# EAGLE design Drone_SMD (EAGLE 9.6.2)
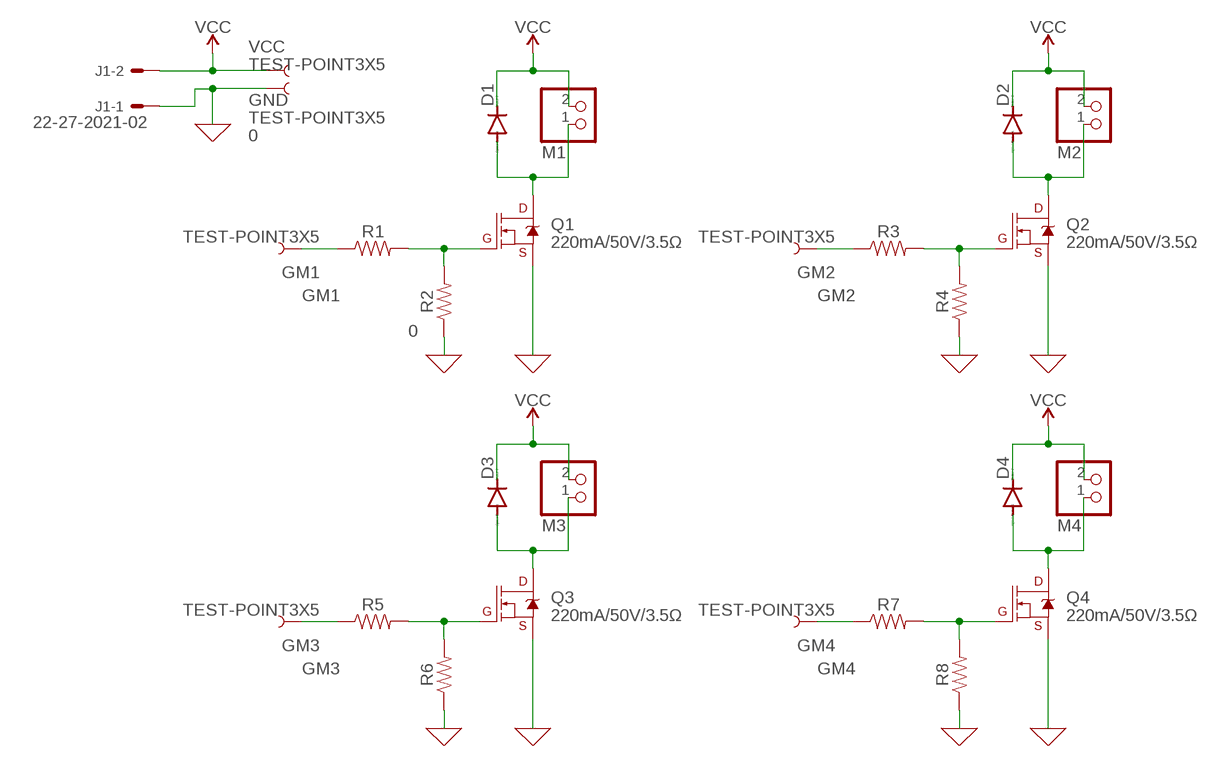
[diagram p0: schematic, sheet 1]

## Parts
D1  DIODE-DO-214AC  [DO-214AC]
D2  DIODE-DO-214AC  [DO-214AC]
D3  DIODE-DO-214AC  [DO-214AC]
D4  DIODE-DO-214AC  [DO-214AC]
GM1  TEST-POINT3X5  [PAD.03X.05]
GM2  TEST-POINT3X5  [PAD.03X.05]
GM3  TEST-POINT3X5  [PAD.03X.05]
GM4  TEST-POINT3X5  [PAD.03X.05]
GND  TEST-POINT3X5  [PAD.03X.05]
J1  22-27-2021-02  [6410-02]
M1  PINHD-1X2  [1X02]
M2  PINHD-1X2  [1X02]
M3  PINHD-1X2  [1X02]
M4  PINHD-1X2  [1X02]
Q1  220mA/50V/3.5Ω  MOSFET-NCH-BSS138  [SOT23-3]
Q2  220mA/50V/3.5Ω  MOSFET-NCH-BSS138  [SOT23-3]
Q3  220mA/50V/3.5Ω  MOSFET-NCH-BSS138  [SOT23-3]
Q4  220mA/50V/3.5Ω  MOSFET-NCH-BSS138  [SOT23-3]
R1  RESISTOR1206  [1206]
R2  RESISTOR1206  [1206]
R3  RESISTOR1206  [1206]
R4  RESISTOR1206  [1206]
R5  RESISTOR1206  [1206]
R6  RESISTOR1206  [1206]
R7  RESISTOR1206  [1206]
R8  RESISTOR1206  [1206]
VCC  TEST-POINT3X5  [PAD.03X.05]

## Nets
0: GND.1 J1.1 Q1.2(S) Q2.2(S) Q3.2(S) Q4.2(S) R2.1 R4.1 R6.1 R8.1 ; supply symbol labelled GND
GM1: GM1.1 R1.1
GM2: GM2.1 R3.1
GM3: GM3.1 R5.1
GM4: GM4.1 R7.1
N$2: Q1.1(G) R1.2 R2.2
N$3: D1.A M1.1 Q1.3(D)
N$5: Q2.1(G) R3.2 R4.2
N$6: D2.A M2.1 Q2.3(D)
N$8: Q3.1(G) R5.2 R6.2
N$9: D3.A M3.1 Q3.3(D)
N$11: Q4.1(G) R7.2 R8.2
N$12: D4.A M4.1 Q4.3(D)
VCC: D1.C D2.C D3.C D4.C J1.2 M1.2 M2.2 M3.2 M4.2 VCC.1

## Library data of the parts
D1-D4 = diode:DIODE-: DIODE
GM1-GM4 GND VCC = SparkFun-Connectors:TEST-POINT: SparkFun Test Points Bare copper test points for troubleshooting or In-Circuit-Testing. These are used by our Production team for verifying production board runs using pogo-pins on test beds. SparkFun Products: SparkFun LSM9DS1 Breakout <https://www.sparkfun.com/products/13284> SparkFun PSOC <https://www.sparkfun.com/products/13714> SparkFun Load Cell Amplifier <https://www.sparkfun.com/products/13879>
J1 = con-molex:22-?-02: CONNECTOR wire to board 2.54 mm (.1 inch) pitch header; MF: MOLEX; OC_FARNELL: unknown; OC_NEWARK: unknown
M1-M4 = pinhead:PINHD-1X2: PIN HEADER
Q1-Q4 = SparkFun-DiscreteSemi:MOSFET-NCH: N-channel MOSFETs Voltage controlled devices that allow control of high current outputs. SparkFun Products: SparkFun OpenScale <https://www.sparkfun.com/products/13261> SparkFun Digital Sandbox <https://www.sparkfun.com/products/12651> SparkFun Monster Moto Shield <https://www.sparkfun.com/products/10182> SparkFun MOSFET Power Controller <https://www.sparkfun.com/products/11214>; PROD_ID: TRANS-00830
R1-R8 = SparkFun-Resistors:RESISTOR: Generic Resistor Package

## Board
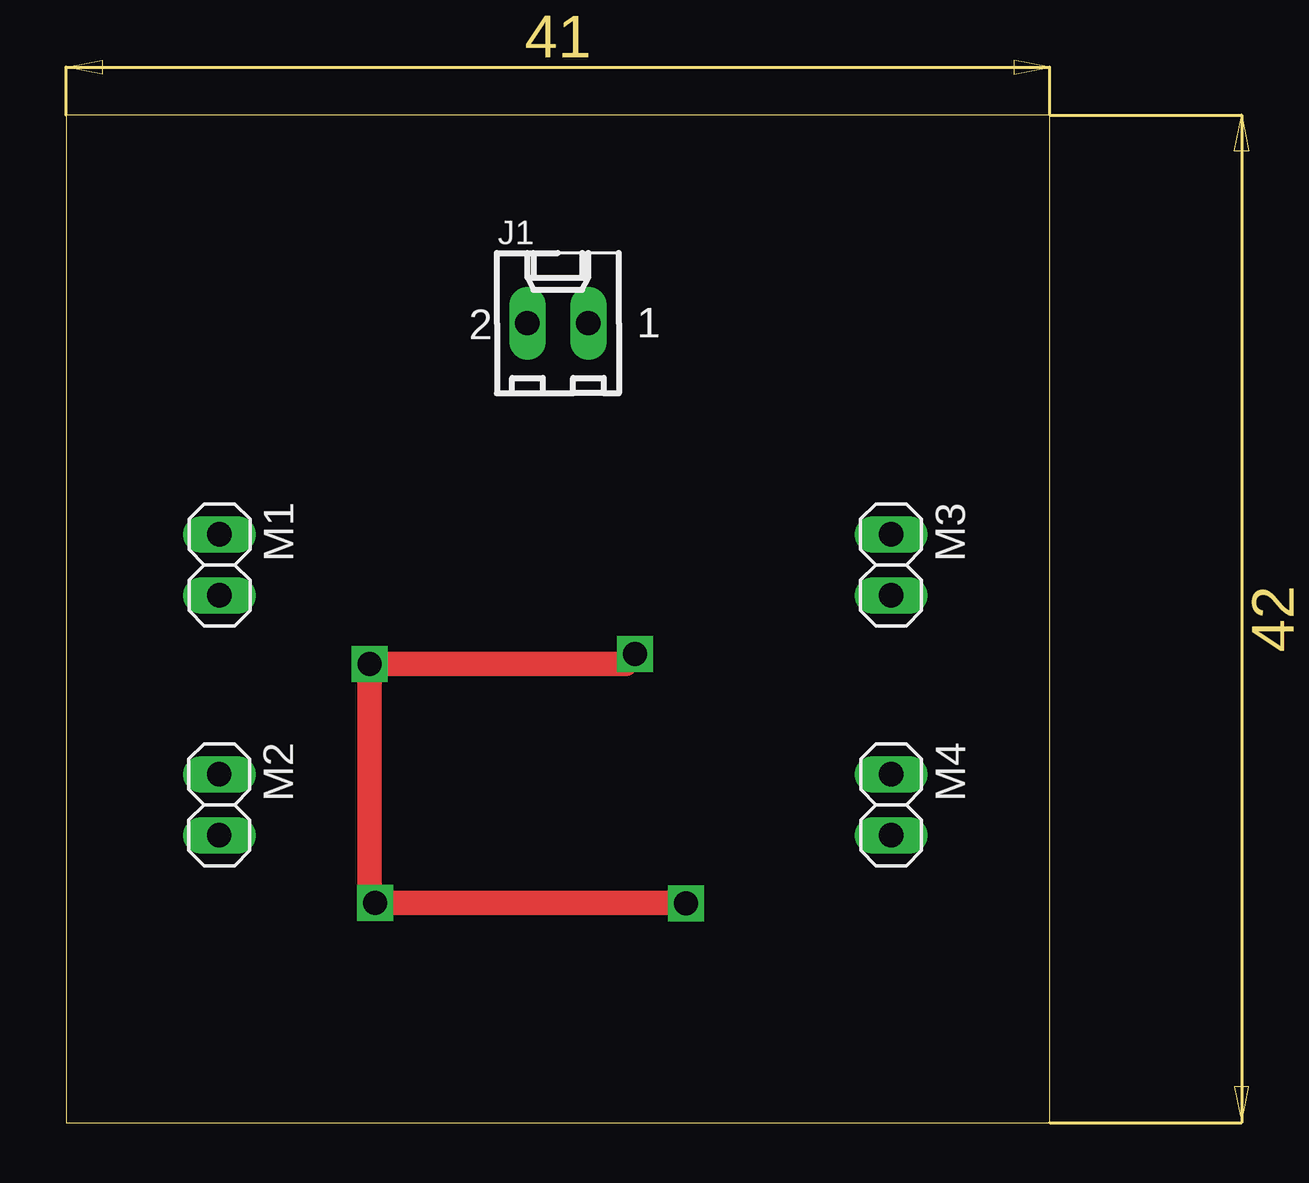
[diagram p1: board, top side]
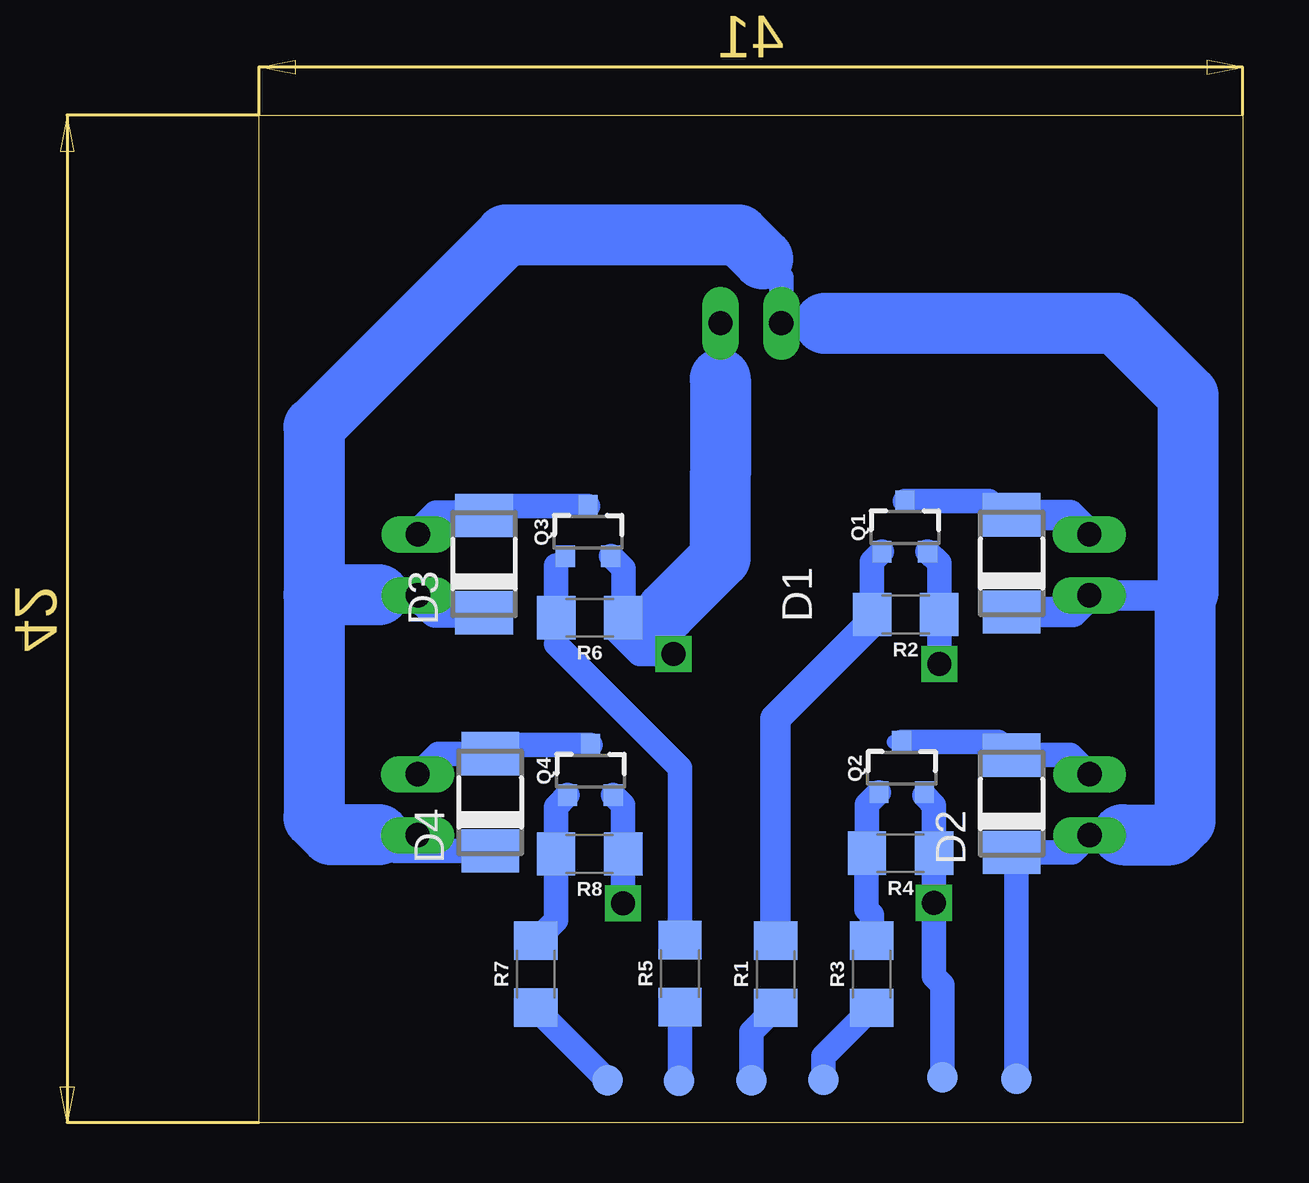
[diagram p2: board, bottom side, seen from below]

Size 41 x 42 mm. Coordinates in mm from the lower left corner, seen from the top.
Outline: 0,0 41,0 41,42 0,42 0,0
Copper layers (1*16): Top 0.035mm / dielectric 1.5mm / Bottom 0.035mm
Design rules "default": minimum track width 6mil, minimum drill 0.35mm, track to track 6mil, track to pad 6mil, pad to pad 6mil, via to via 6mil, smd to smd 6mil, copper to edge 40mil, drill to drill 6mil, minimum pad ring 10mil, minimum via ring 8mil, stop-mask expansion 4mil, vias tented up to drill 0mil, thermal gap 10mil

### Footprints (pad centres in the part's own frame; a part is rotated, then mirrored left to right if it is on the bottom)
DO-214AC = smd 1.8 x 2.4: A 2.025,0; C -2.025,0
PAD.03X.05 = smd 1.27 x 1.27: 1 0,0
6410-02 = drill 1.016 long: 1 1.27,0; 2 -1.27,0
1X02 = drill 1.016 long: 1 -1.27,0; 2 1.27,0
SOT23-3 = smd 0.8 x 0.9: 1 -0.95,-1; 2 0.95,-1; 3 0,1.1
1206 = smd 1.6 x 1.8: 1 -1.4,0; 2 1.4,0

### Placement (x,y rotation side)
D1  9.63,23.32 90 bottom
D2  9.63,13.3 90 bottom
D3  31.62,23.29 90 bottom
D4  31.37,13.36 90 bottom
GM1  20.47,1.77 270 bottom
GM2  17.48,1.78 270 bottom
GM3  23.5,1.76 270 bottom
GM4  26.48,1.77 270 bottom
GND  12.52,1.89 90 bottom
J1  20.5,33.33 0 top
M1  6.39,23.25 270 top
M2  6.38,13.25 270 top
M3  34.38,23.25 270 top
M4  34.39,13.26 270 top
Q1  14.08,24.81 0 bottom
Q2  14.22,14.77 0 bottom
Q3  27.29,24.62 0 bottom
Q4  27.19,14.66 0 bottom
R1  19.47,6.19 90 bottom
R2  14.05,21.18 180 bottom
R3  15.46,6.19 90 bottom
R4  14.27,11.24 180 bottom
R5  23.46,6.22 90 bottom
R6  27.22,21.05 180 bottom
R7  29.46,6.2 90 bottom
R8  27.22,11.2 180 bottom
VCC  9.44,1.84 0 bottom

### Tracks (layer width: path | path; a pad name or v marks a point on that pad's centre or on a via)
0  (via drill 1)
  Top 1.016: v23.72,19.54 23.31,19.13 v12.65,19.13 12.65,9.39 v12.88,9.16 25.82,9.16 v25.83,9.15
  Bottom 0.61: 25.82,21.33 R6.1 | Q4.2 26.24,13.57 | Q2.2 13.27,13.64 13.27,13.6
  Bottom 1.016: J1.1 21.77,31 | v12.65,19.13 R2.1 12.65,23.32 Q1.2 | Q3.2 25.82,23.09 R6.1 25.24,21.05 v23.72,19.54 | Q4.2 25.82,13.24 R8.1 v25.83,9.15 | 13.27,13.64 12.87,13.23 R4.1 12.88,11.22 v12.88,9.16 12.88,6.11 12.52,5.74 GND.1 | v23.72,19.54 23.72,21.05 24,21.33 | v23.72,19.54 25.13,19.54 26.11,20.52
  Bottom 1.27: 24,21.33 25.82,21.33
  Bottom 2.54: 21.77,31 21.77,27 21.77,23.56 24,21.33
GM1
  Bottom 1.016: R1.1 20.47,3.79 GM1.1
GM2
  Bottom 1.016: GM2.1 17.48,2.78 R3.1
GM3
  Bottom 0.61: 23.46,1.79 GM3.1
  Bottom 1.016: R5.1 23.46,1.79
GM4
  Bottom 0.61: 29.46,4.75 R7.1
  Bottom 1.016: GM4.1 29.46,4.75
N$2
  Bottom 0.61: 15.6,21.33 R2.2
  Bottom 1.016: Q1.1 15.45,23.39 R2.2
  Bottom 1.27: R1.2 19.47,16.86 15.6,20.73 15.6,21.33
N$3
  Bottom 0.61: 10.01,25.34 D1.A
  Bottom 1.016: Q1.3 10.58,25.91 10.01,25.34
  Bottom 1.27: M1.1 7.21,25.34 D1.A
N$5
  Bottom 0.61: 15.46,11.04 R4.2
  Bottom 1.016: R4.2 15.67,13.28 Q2.1 | R3.2 15.46,8.67 15.68,8.89 15.68,10.82 15.46,11.04
N$6
  Bottom 0.61: Q2.3 14.54,15.87
  Bottom 1.016: M2.1 7.18,15.32 D2.A 10.18,15.87 Q2.3
N$8
  Bottom 0.61: Q3.1 28.62,23.24 | 28.62,19.95 R6.2
  Bottom 1.016: 28.62,23.24 R6.2 | R5.2 23.46,14.79 28.62,19.95
N$9
  Bottom 1.016: Q3.3 31.22,25.72 D3.A
  Bottom 1.27: M3.1 33.59,25.31 D3.A
N$11
  Bottom 0.61: R8.2 28.62,10.2
  Bottom 1.016: Q4.1 28.62,13.17 R8.2 28.62,8.44 R7.2
N$12
  Bottom 0.61: D4.A 32.05,15.38
  Bottom 1.016: M4.1 33.54,15.38 D4.A 31,15.76 Q4.3
VCC
  Bottom 1.016: 35.06,21.98 M3.2 34.4,22 36,22 | VCC.1 9.44,11.08 D2.C 7.09,11.28 M2.2 5.01,11.98 5,12 | 17.42,33.32 17.43,33.33 J1.2 19.23,35.23 20,36 | M4.2 34.41,12 36,12 35.33,11.33 D4.C 33.74,11.33 M4.2
  Bottom 1.27: M1.2 7.09,21.29 D1.C | M3.2 33.66,21.26 D3.C | M1.2 2.4,21.98 2.29,22.1 | M1.2 5.69,21.98
  Bottom 2.54: 2.29,22.1 2.29,30.33 5.29,33.33 17.43,33.33 | 2.4,21.98 2.4,12.6 3,12 5,12 | 20,36 21,37 30.71,37 38.71,29 38.71,22 | 38.71,22 38.71,12.71 38,12 36,12 | 36,22 38.71,22